# EAGLE design Nu2031_Conn (EAGLE 7.7.0)
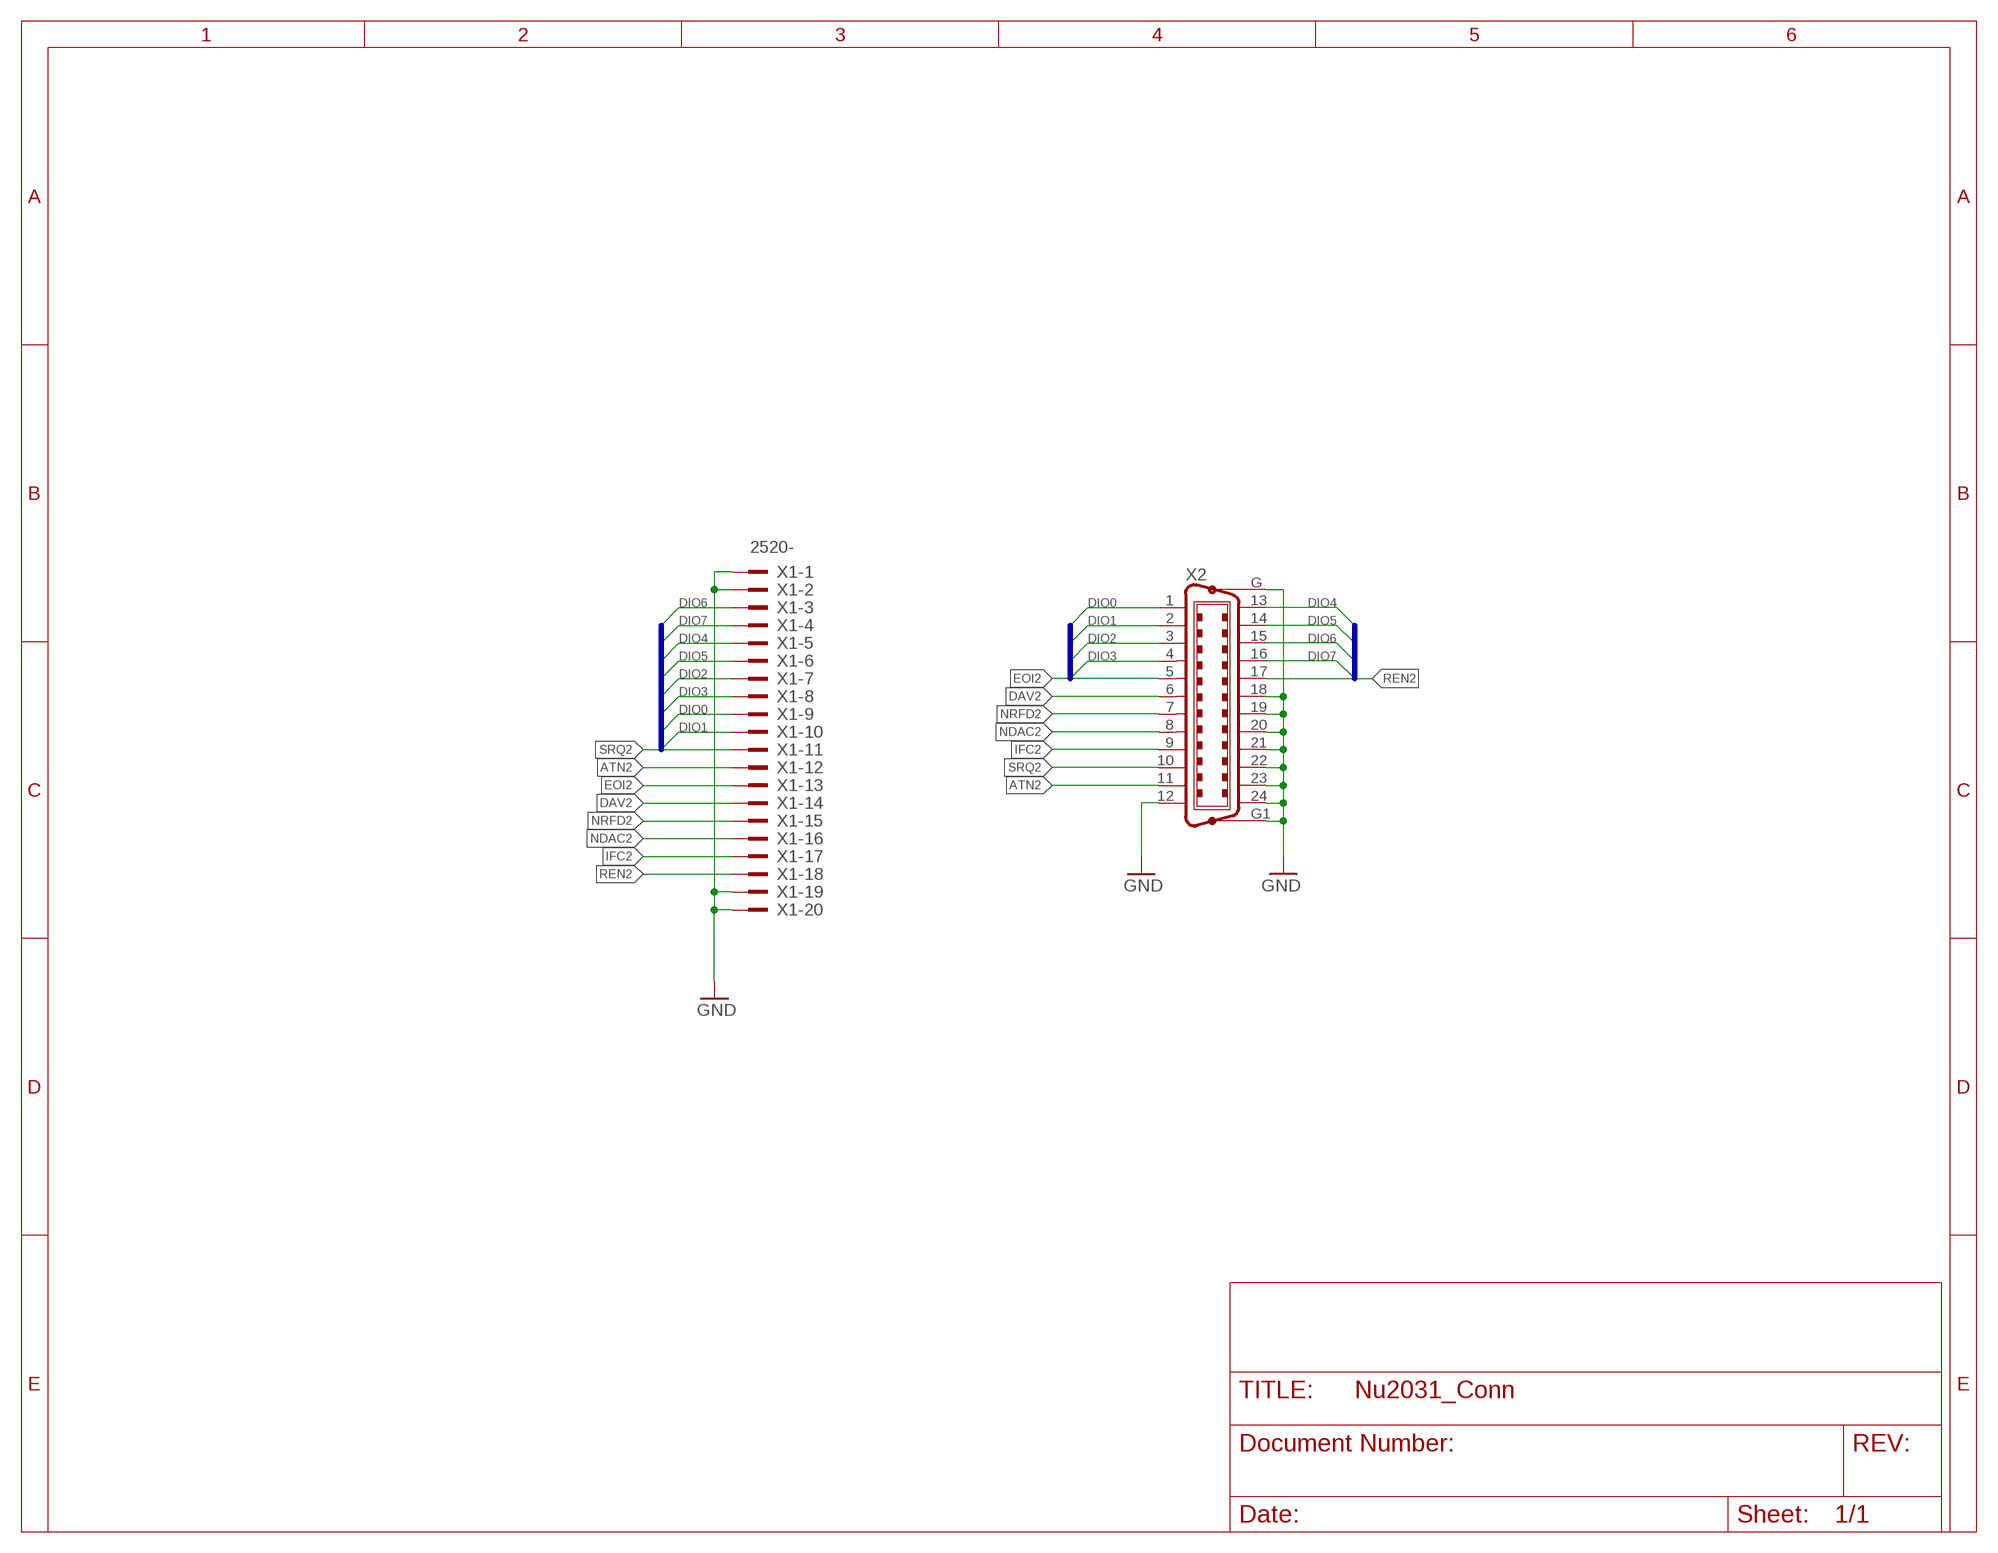
[diagram p0: schematic, sheet 1]

## Parts
X1  2520-  [PAK100/2500-20]
X2  C24HP  [24HP]

## Nets
ATN2: X1.12 X2.11
DAV2: X1.14 X2.6
DIO0: X1.9 X2.1
DIO1: X1.10 X2.2
DIO2: X1.7 X2.3
DIO3: X1.8 X2.4
DIO4: X1.5 X2.13
DIO5: X1.6 X2.14
DIO6: X1.3 X2.15
DIO7: X1.4 X2.16
EOI2: X1.13 X2.5
GND: X1.1 X1.2 X1.19 X1.20 X2.12 X2.18 X2.19 X2.20 X2.21 X2.22 X2.23 X2.24 X2.G X2.G1
IFC2: X1.17 X2.9
NDAC2: X1.16 X2.8
NRFD2: X1.15 X2.7
REN2: X1.18 X2.17
SRQ2: X1.11 X2.10

## Buses
DIO[0..7]

## Library data of the parts
X1 = con-3m:2520-: 3M (TM) Pak 100 4-Wall Header Source: 3M; OC_FARNELL: unknown; OC_NEWARK: unknown
X2 = con-amp-champ:C24HP: CONNECTOR; OC_FARNELL: unknown; OC_NEWARK: unknown

## Board
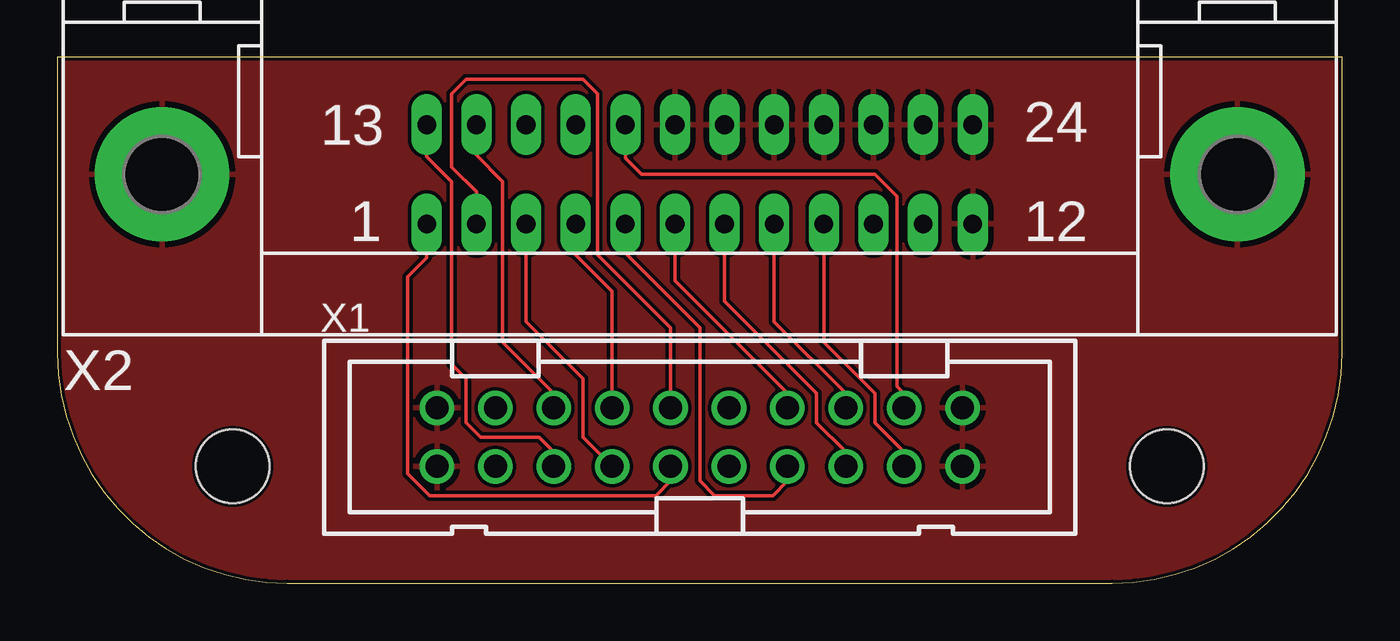
[diagram p1: board, top side]
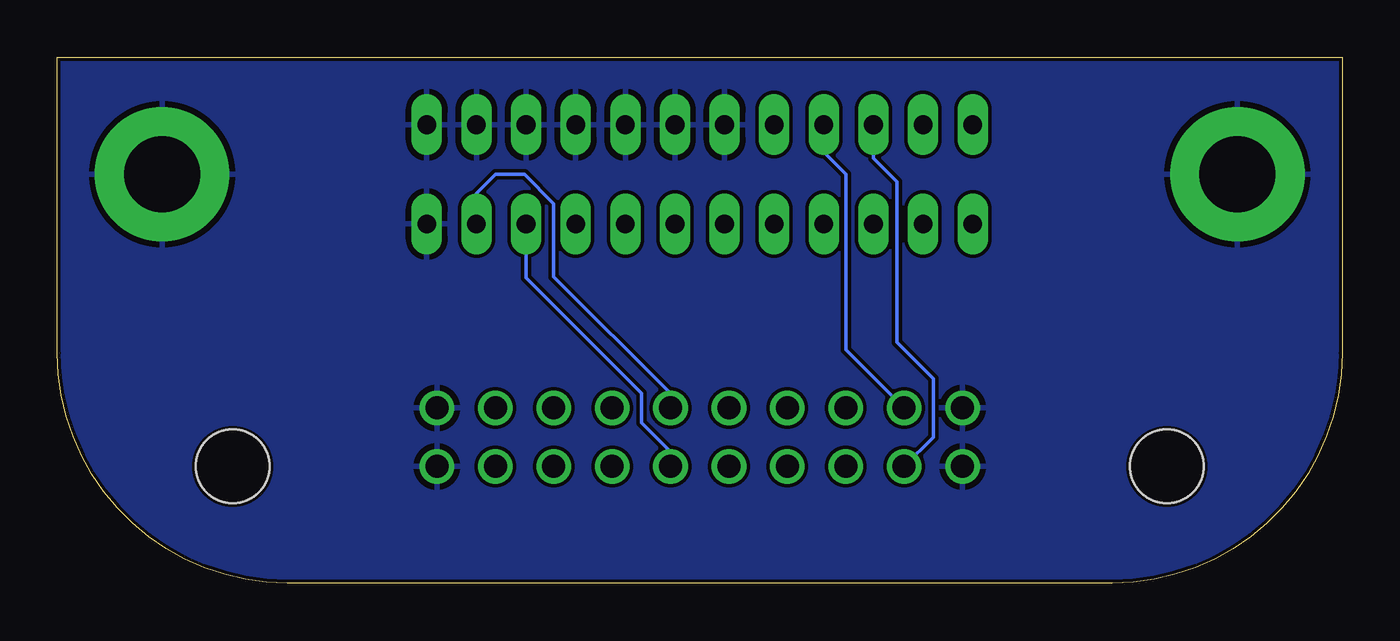
[diagram p2: board, bottom side, seen from below]

Size 55.88 x 22.86 mm. Coordinates in mm from the lower left corner, seen from the top.
Outline: 10,0 45.88,0 arc90 55.88,10 55.88,22.86 0,22.86 0,10 arc90 10,0
Copper layers (1*16): Top 0.035mm / dielectric 1.5mm / Bottom 0.035mm
Design rules "hackvana": minimum track width 6mil, minimum drill 0.3mm, track to track 6mil, track to pad 6mil, pad to pad 6mil, via to via 6mil, smd to smd 0mil, copper to edge 6mil, drill to drill 6mil, minimum pad ring 10mil, minimum via ring 6mil, stop-mask expansion 2mil, vias tented up to drill 100mil, thermal gap 10mil
Holes 3.2 mm at 7.62,5.08 48.26,5.08

### Footprints (pad centres in the part's own frame; a part is rotated, then mirrored left to right if it is on the bottom)
PAK100/2500-20 = drill 1 pad 1.422: 1 -11.43,-1.27; 2 -11.43,1.27; 3 -8.89,-1.27; 4 -8.89,1.27; 5 -6.35,-1.27; 6 -6.35,1.27; 7 -3.81,-1.27; 8 -3.81,1.27; 9 -1.27,-1.27; 10 -1.27,1.27; 11 1.27,-1.27; 12 1.27,1.27; 13 3.81,-1.27; 14 3.81,1.27; 15 6.35,-1.27; 16 6.35,1.27; 17 8.89,-1.27; 18 8.89,1.27; 19 11.43,-1.27; 20 11.43,1.27
24HP = drill 0.813 long: 1 -11.874,-2.159; 2 -9.716,-2.159; 3 -7.556,-2.159; 4 -5.397,-2.159; 5 -3.239,-2.159; 6 -1.079,-2.159; 7 1.079,-2.159; 8 3.239,-2.159; 9 5.397,-2.159; 10 7.556,-2.159; 11 9.716,-2.159; 12 11.874,-2.159; 13 -11.874,2.159; 14 -9.716,2.159; 15 -7.556,2.159; 16 -5.397,2.159; 17 -3.239,2.159; 18 -1.079,2.159; 19 1.079,2.159; 20 3.239,2.159; 21 5.397,2.159; 22 7.556,2.159; 23 9.716,2.159; 24 11.874,2.159 | drill 3.302 pad 5.842: G -23.393,0; G1 23.393,0

### Placement (x,y rotation side)
X1  27.94,6.35 0 top
X2  27.94,17.78 0 top

### Tracks (layer width: path | path; a pad name or v marks a point on that pad's centre or on a via)
ATN2
  Bottom 0.152: X2.11 37.66,16.95 36.83,17.78 35.56,17.78 34.29,16.51 34.29,13.34 29.21,8.26 X1.12
DAV2
  Top 0.152: X2.6 26.86,13.14 31.75,8.26 X1.14
DIO0
  Top 0.152: X2.1 16.07,14.16 15.24,13.34 15.24,4.76 16.19,3.81 26.04,3.81 26.67,4.45 X1.9
DIO1
  Top 0.152: X1.10 26.67,11.11 23.5,14.29 23.5,21.27 22.86,21.91 17.78,21.91 17.15,21.27 17.15,18.1 18.22,17.02 X2.2
DIO2
  Top 0.152: X2.3 20.38,11.37 22.86,8.89 22.86,6.35 X1.7
DIO3
  Top 0.152: X2.4 22.54,14.29 24.13,12.7 X1.8
DIO4
  Top 0.152: X1.5 21.59,5.71 20.96,6.35 18.41,6.35 17.78,6.99 17.78,8.89 17.15,9.53 17.15,17.46 16.07,18.54 X2.13
DIO5
  Top 0.152: X2.14 18.22,18.61 19.37,17.46 19.37,10.48 21.59,8.26 X1.6
DIO6
  Bottom 0.152: X2.15 20.38,18.48 19.37,17.46 19.37,10.48 17.78,8.89 17.78,6.35 X1.3
DIO7
  Bottom 0.152: X2.16 22.54,18.73 21.59,17.78 21.59,10.16 X1.4
EOI2
  Top 0.152: X2.5 24.7,14.35 27.94,11.11 27.94,4.45 28.58,3.81 31.12,3.81 31.75,4.45 X1.13
GND
  pour Bottom: 55.88,22.86 55.88,10 arc-90 45.88,0 10,0 arc-90 0,10 0,22.86
  pour Top: 0,22.86 0,10 arc90 10,0 45.88,0 arc90 55.88,10 55.88,22.86
IFC2
  Top 0.152: X2.9 33.34,10.48 35.56,8.26 35.56,6.99 36.83,5.71 X1.17
NDAC2
  Top 0.152: X2.8 31.18,11.37 34.29,8.26 X1.16
NRFD2
  Top 0.152: X2.7 29.02,12.26 33.02,8.26 33.02,6.99 34.29,5.71 X1.15
REN2
  Top 0.152: X2.17 24.7,18.48 25.4,17.78 35.56,17.78 36.51,16.83 36.51,8.57 36.83,8.26 X1.18
SRQ2
  Bottom 0.152: X2.10 35.5,13.27 30.48,8.26 30.48,6.99 29.21,5.71 X1.11